# EAGLE design clocktal (EAGLE 7.2.0)
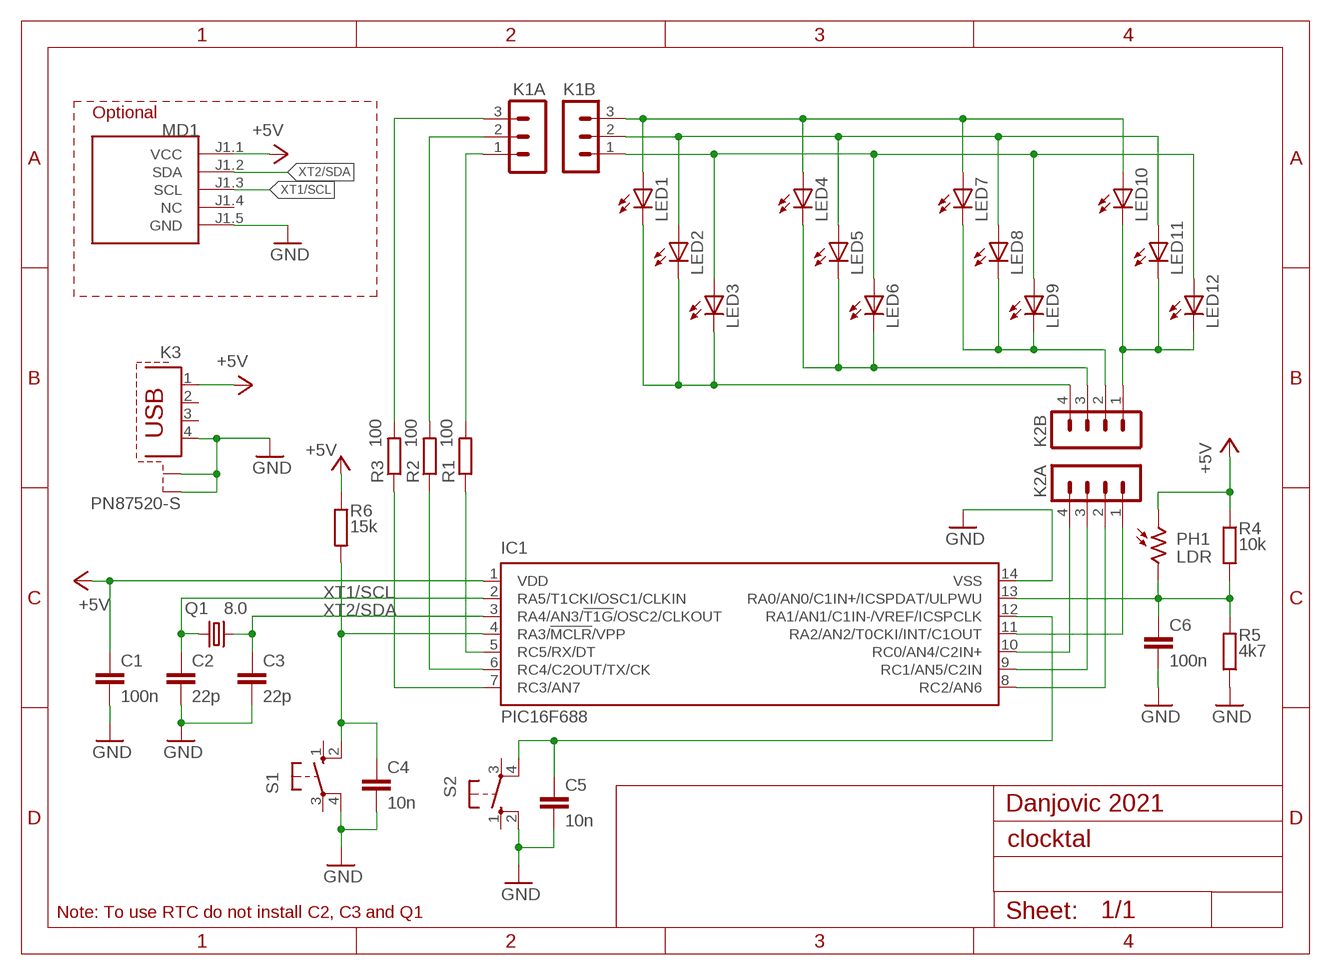
[diagram p0: schematic, sheet 1]

## Parts
C1  100n  C-EUC050-025X075L  [C050-025X75L]
C2  22p  C-EUC050-024X044L  [C050-024X044L]
C3  22p  C-EUC050-024X044L  [C050-024X044L]
C4  10n  C-EUC050-025X075L  [C050-025X75L]
C5  10n  C-EUC050-025X075L  [C050-025X75L]
C6  100n  C-EUC050-025X075L  [C050-025X75L]
IC1  PIC16F688  [DIL14]
K1A  MA03-1  [MA03-1]
K1B  MA03-1  [MA03-1]
K2A  MA04-1  [MA04-1]
K2B  MA04-1  [MA04-1]
K3  PN87520-S  [PN87520-S]
LED1  LED3MM_L  [LED3MM_L]
LED2  LED3MM_L  [LED3MM_L]
LED3  LED3MM_L  [LED3MM_L]
LED4  LED3MM_L  [LED3MM_L]
LED5  LED3MM_L  [LED3MM_L]
LED6  LED3MM_L  [LED3MM_L]
LED7  LED3MM_L  [LED3MM_L]
LED8  LED3MM_L  [LED3MM_L]
LED9  LED3MM_L  [LED3MM_L]
LED10  LED3MM_L  [LED3MM_L]
LED11  LED3MM_L  [LED3MM_L]
LED12  LED3MM_L  [LED3MM_L]
MD1  RTC-DS3231_L  [RTC-DS3231-SMALL_L]
PH1  LDR  A1050_09  [T0-46-A10XX]
Q1  8.0  CRYSTALHC49U-V  [HC49U-V]
R1  100  R-EU_0204/7L  [0204/7L]
R2  100  R-EU_0204/7L  [0204/7L]
R3  100  R-EU_0204/7L  [0204/7L]
R4  10k  R-EU_0204/7L  [0204/7L]
R5  4k7  R-EU_0204/7L  [0204/7L]
R6  15k  R-EU_0204/7L  [0204/7L]
S1  10-XX  [B3F-10XX]
S2  10-XX  [B3F-10XX]

## Nets
+5V: C1.1 IC1.1(VDD) K3.1 MD1.J1.1(VCC) PH1.1 R4.1 R6.1
B0: K1B.1 LED3.A LED6.A LED9.A LED12.A
B1: K1B.2 LED2.A LED5.A LED8.A LED11.A
B2: K1B.3 LED1.A LED4.A LED7.A LED10.A
BIT0: IC1.5(RC5/RX/DT) R1.1
BIT0A: K1A.1 R1.2
BIT1: IC1.6(RC4/C2OUT/TX/CK) R2.1
BIT1A: K1A.2 R2.2
BIT2: IC1.7(RC3/AN7) R3.1
BIT2A: K1A.3 R3.2
BUTTON1: C4.1 IC1.4(RA3/!MCLR!/VPP) R6.2 S1.2(S1)
BUTTON2: C5.1 IC1.12(RA1/AN1/C1IN-/VREF/ICSPCLK) S2.4(P1)
DGT0: K2B.1 LED10.K(C) LED11.K(C) LED12.K(C)
DGT1: K2B.2 LED7.K(C) LED8.K(C) LED9.K(C)
DGT2: K2B.3 LED4.K(C) LED5.K(C) LED6.K(C)
DGT3: K2B.4 LED1.K(C) LED2.K(C) LED3.K(C)
DIGIT0: IC1.11(RA2/AN2/T0CKI/INT/C1OUT) K2A.1
DIGIT1: IC1.8(RC2/AN6) K2A.2
DIGIT2: IC1.9(RC1/AN5/C2IN) K2A.3
DIGIT3: IC1.10(RC0/AN4/C2IN+) K2A.4
GND: C1.2 C2.2 C3.2 C4.2 C5.2 C6.2 IC1.14(VSS) K3.4 K3.S1 K3.S2 MD1.J1.5(GND) R5.1 S1.4(P1) S2.2(S1)
LDR: C6.1 IC1.13(RA0/AN0/C1IN+/ICSPDAT/ULPWU) PH1.2 R4.2 R5.2
XT1/SCL: C2.1 IC1.2(RA5/T1CKI/OSC1/CLKIN) MD1.J1.3(SCL) Q1.1
XT2/SDA: C3.1 IC1.3(RA4/AN3/!T1G!/OSC2/CLKOUT) MD1.J1.2(SDA) Q1.2
Unconnected: K3.2 K3.3 MD1.J1.4(NC) S1.1(S) S1.3(P) S2.1(S) S2.3(P)

## Notes on the sheet
- Optional
- Danjovic 2021
- Note: To use RTC do not install C2, C3 and Q1

## Library data of the parts
C1-C6 = rcl:C-EU: CAPACITOR, European symbol
IC1 = microchip:PIC16F68*
K1A K1B = con-lstb:MA03-1: PIN HEADER; OC_FARNELL: unknown; OC_NEWARK: unknown
K2A K2B = con-lstb:MA04-1: PIN HEADER; OC_FARNELL: unknown; OC_NEWARK: unknown
K3 = con-berg:PN87520-S; OC_FARNELL: unknown; OC_NEWARK: unknown
LED1-LED12 = led:LED: LED OSRAM: - CHIPLED LG R971, LG N971, LY N971, LG Q971, LY Q971, LO R971, LY R971 LH N974, LH R974 LS Q976, LO Q976, LY Q976 LO Q996 - Hyper CHIPLED LW Q18S LB Q993, LB Q99A, LB R99A - SideLED LS A670, LO A670, LY A670, LG A670, LP A670 LB A673, LV A673, LT A673, LW A673 LH A674 LY A675 LS A676, LA A676, LO A676, LY A676, LW A676 LS A679, LY A679, LG A679 - Hyper Micro SIDELED® LS Y876, LA Y876, LO Y876, LY Y876 LT Y87S - SmartLED LW L88C, LW L88S LB L89C, LB L89S, LG L890 LS L89K, LO L89K, LY L89K LS L896, LA L896, LO L896, LY L896 - TOPLED LS T670, LO T670, LY T670, LG T670, LP T670 LSG T670, LSP T670, LSY T670, LOP T670, LYG T670 LG T671, LOG T671, LSG T671 LB T673, LV T673, LT T673, LW T673 LH T674 LS T676, LA T676, LO T676, LY T676, LB T676, LH T676, LSB T676, LW T676 LB T67C, LV T67C, LT T67C, LS T67K, LO T67K, LY T67K, LW E67C LS E67B, LA E67B, LO E67B, LY E67B, LB E67C, LV E67C, LT E67C LW T67C LS T679, LY T679, LG T679 LS T770, LO T770, LY T770, LG T770, LP T770 LB T773, LV T773, LT T773, LW T773 LH T774 LS E675, LA E675, LY E675, LS T675 LS T776, LA T776, LO T776, LY T776, LB T776 LHGB T686 LT T68C, LB T68C - Hyper Mini TOPLED® LB M676 - Mini TOPLED Santana® LG M470 LS M47K, LO M47K, LY M47K Source: http://www.osram.convergy.de LUXEON: - LUMILED® LXK2-PW12-R00, LXK2-PW12-S00, LXK2-PW14-U00, LXK2-PW14-V00 LXK2-PM12-R00, LXK2-PM12-S00, LXK2-PM14-U00 LXK2-PE12-Q00, LXK2-PE12-R00, LXK2-PE12-S00, LXK2-PE14-T00, LXK2-PE14-U00 LXK2-PB12-K00, LXK2-PB12-L00, LXK2-PB12-M00, LXK2-PB14-N00, LXK2-PB14-P00, LXK2-PB14-Q00 LXK2-PR12-L00, LXK2-PR12-M00, LXK2-PR14-Q00, LXK2-PR14-R00 LXK2-PD12-Q00, LXK2-PD12-R00, LXK2-PD12-S00 LXK2-PH12-R00, LXK2-PH12-S00 LXK2-PL12-P00, LXK2-PL12-Q00, LXK2-PL12-R00 Source: www.luxeon.com KINGBRIGHT: KA-3528ASYC Source: www.kingbright.com
MD1 = RTC:RTC-DS3231
PH1 = photo-elements:A10: Sensor Robust Light Sensing Applications Outdoor Light Sensing Application Source: http://optoelectronics.perkinelmer.com/content/Datasheets/DTS_PhotocellsA1050.pdf
Q1 = crystal:CRYSTAL: CRYSTAL; OC_FARNELL: 1666969; OC_NEWARK: unknown
R1-R6 = rcl:R-EU_: RESISTOR, European symbol
S1 S2 = switch-omron:10-XX: OMRON SWITCH; MPN: B3F-1000; OC_FARNELL: 176432; OC_NEWARK: 36M3542

## Board
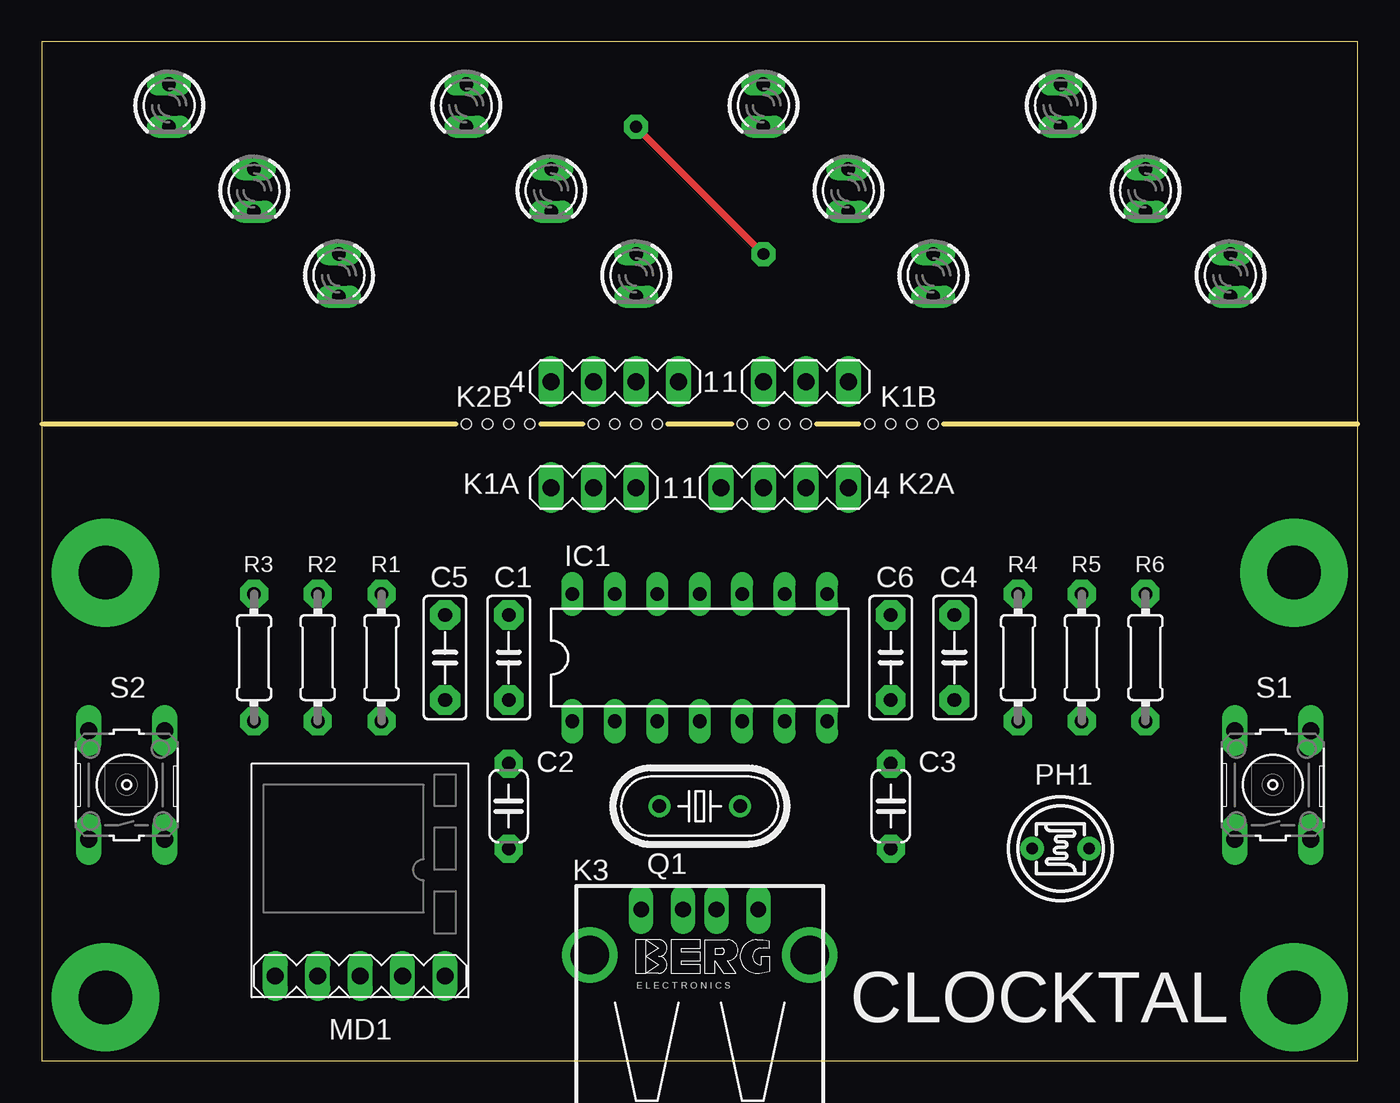
[diagram p1: board, top side]
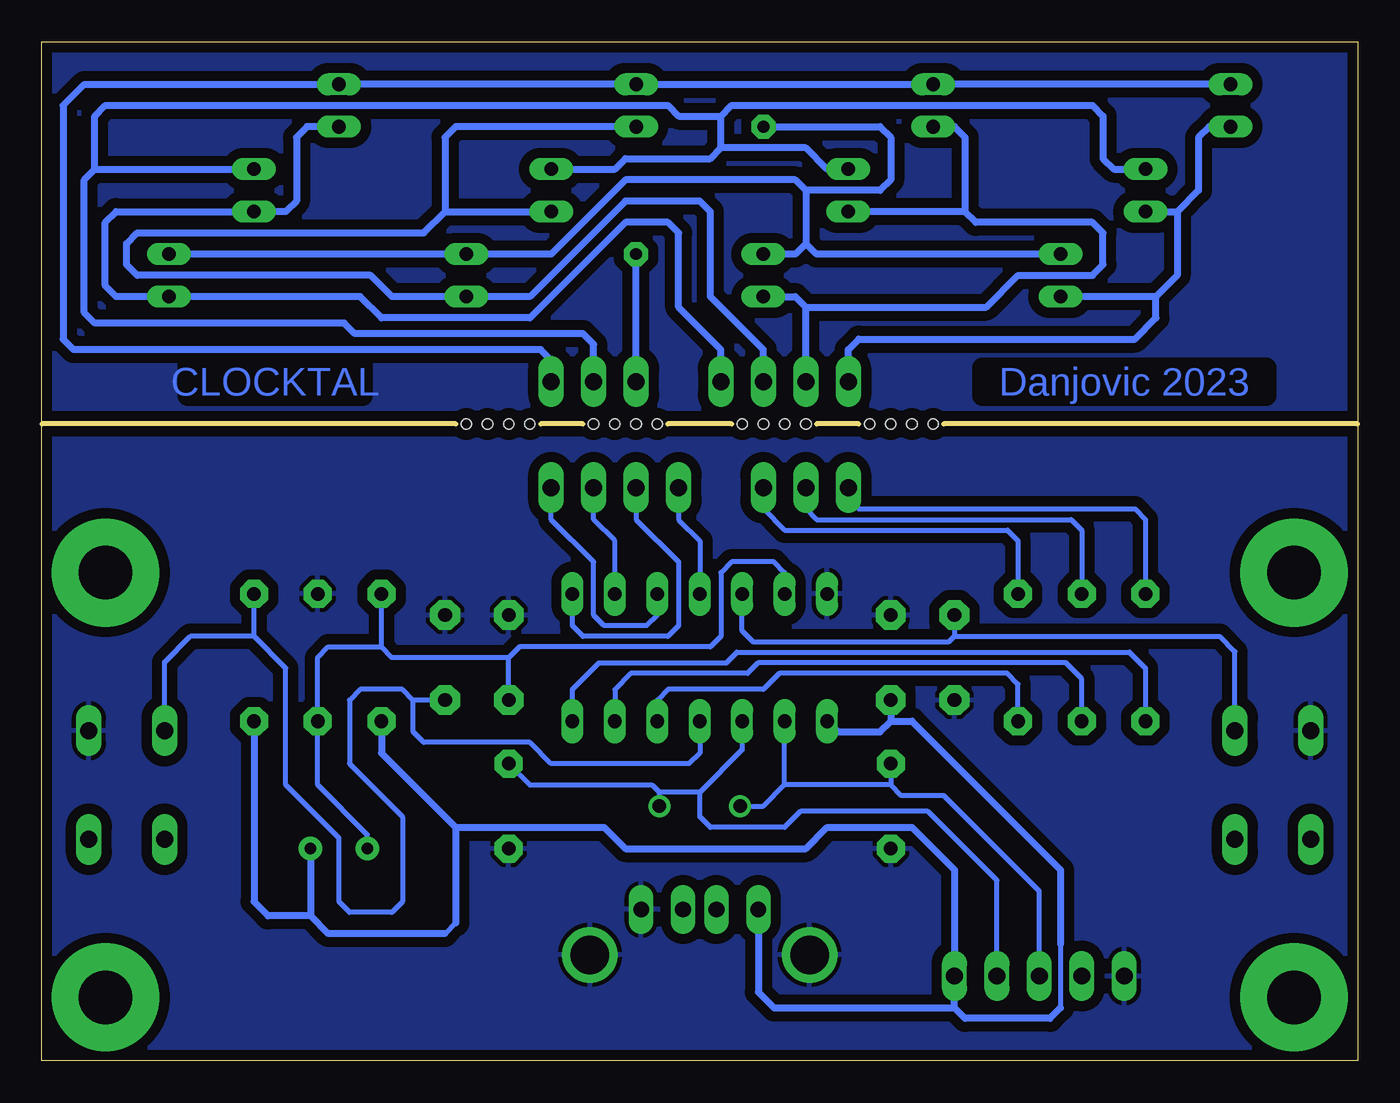
[diagram p2: board, bottom side, seen from below]

Size 78.74 x 60.96 mm. Coordinates in mm from the lower left corner, seen from the top.
Outline: 0,0 78.74,0 78.74,60.96 0,60.96 0,0
Copper layers (1*16): Top 0.035mm / dielectric 1.5mm / Bottom 0.035mm
Design rules "default *": minimum track width 10mil, minimum drill 24mil, track to track 8mil, track to pad 8mil, pad to pad 8mil, via to via 8mil, smd to smd 8mil, copper to edge 25mil, drill to drill 8mil, minimum pad ring 10mil, minimum via ring 8mil, stop-mask expansion 4mil, vias tented up to drill 0mil, thermal gap 10mil
Holes 0.6 mm at 25.4,38.1 27.94,38.1 33.02,38.1 35.56,38.1 43.18,38.1 45.72,38.1 50.8,38.1 53.34,38.1 29.21,38.1 34.29,38.1 36.83,38.1 41.91,38.1 44.45,38.1 49.53,38.1 52.07,38.1 26.67,38.1
bRestrict: 5 lines
Milling: 5 lines

### Footprints (pad centres in the part's own frame; a part is rotated, then mirrored left to right if it is on the bottom)
C050-025X75L = drill 0.813 pad 1.778 octagon: 1 -2.54,0; 2 2.54,0
C050-024X044L = drill 0.813 pad 1.676 octagon: 1 -2.54,0; 2 2.54,0
DIL14 = drill 0.813 long: 1 -7.62,-3.81; 2 -5.08,-3.81; 3 -2.54,-3.81; 4 0,-3.81; 5 2.54,-3.81; 6 5.08,-3.81; 7 7.62,-3.81; 8 7.62,3.81; 9 5.08,3.81; 10 2.54,3.81; 11 0,3.81; 12 -2.54,3.81; 13 -5.08,3.81; 14 -7.62,3.81
MA03-1 = drill 1.016 long: 1 -2.54,0; 2 0,0; 3 2.54,0
MA04-1 = drill 1.016 long: 1 -3.81,0; 2 -1.27,0; 3 1.27,0; 4 3.81,0
PN87520-S = drill 0.95 long: 1 -3.5,2.71; 2 -1,2.71; 3 1,2.71; 4 3.5,2.71 | drill 2.3 pad 2.9: S1 -6.57,0; S2 6.57,0
LED3MM_L = drill 0.813 long: A -1.27,0; K 1.27,0
RTC-DS3231-SMALL_L = drill 1 long: J1.1 -5.08,6.35; J1.2 -2.54,6.35; J1.3 0,6.35; J1.4 2.54,6.35; J1.5 5.08,6.35
T0-46-A10XX = drill 0.7 pad 1.4: 1 -1.7,0; 2 1.7,0
HC49U-V = drill 0.813: 1 -2.413,0; 2 2.413,0
0204/7L = drill 0.813 pad 1.676 octagon: 1 -3.81,0; 2 3.81,0
B3F-10XX = drill 1.016 long: 1 -3.251,2.261; 2 3.251,2.261; 3 -3.251,-2.261; 4 3.251,-2.261

### Placement (x,y rotation side)
C1  27.94,24.13 90 top
C2  27.94,15.24 270 top
C3  50.8,15.24 270 top
C4  54.61,24.13 90 top
C5  24.13,24.13 270 top
C6  50.8,24.13 90 top
IC1  39.37,24.13 0 top
K1A  33.02,34.29 180 top
K1B  45.72,40.64 0 top
K2A  44.45,34.29 0 top
K2B  34.29,40.64 180 top
K3  39.37,6.35 0 top
LED1  7.62,57.15 270 top
LED2  12.7,52.07 270 top
LED3  17.78,46.99 270 top
LED4  25.4,57.15 270 top
LED5  30.48,52.07 270 top
LED6  35.56,46.99 270 top
LED7  43.18,57.15 270 top
LED8  48.26,52.07 270 top
LED9  53.34,46.99 270 top
LED10  60.96,57.15 270 top
LED11  66.04,52.07 270 top
LED12  71.12,46.99 270 top
MD1  19.05,11.43 180 top
PH1  60.96,12.7 180 top
Q1  39.37,15.24 0 top
R1  20.32,24.13 90 top
R2  16.51,24.13 90 top
R3  12.7,24.13 90 top
R4  58.42,24.13 90 top
R5  62.23,24.13 270 top
R6  66.04,24.13 90 top
S1  73.66,16.51 90 top
S2  5.08,16.51 90 top

### Tracks (layer width: path | path; a pad name or v marks a point on that pad's centre or on a via)
+5V
  Bottom 0.305: 53.98,8.26 54.61,7.62 | 17.78,6.99 17.78,3.17
  Bottom 0.406: R6.1 66.04,9.53 65.2,8.69 62.66,8.69 | K3.1 35.87,4.12 34.92,3.17 24.13,3.17 | 24.13,3.17 MD1.J1.1 24.13,11.43 26.67,13.97 31.75,13.97 33.02,12.7 43.81,12.7 45.09,13.97 53.98,13.97 | IC1.1 31.11,19.68 28.57,19.68 27.94,20.32 | 27.94,20.32 26.67,20.32 17.78,11.43 17.78,6.99 | 17.78,3.17 18.41,2.54 23.5,2.54 24.13,3.17 | R4.1 58.42,18.41 53.98,13.97 | 53.98,13.97 53.98,8.26 | 54.61,7.62 61.59,7.62 62.66,8.69 | PH1.1 62.66,8.69 | C1.1 27.94,20.32
B0  (via drill 0.7 pad 1.42)
  Top 0.406: v43.18,48.26 v35.56,55.88
  Bottom 0.406: LED3.A 32.38,48.26 33.02,48.9 | 33.02,48.9 33.66,48.26 LED6.A | LED12.A LED9.A 48.26,48.26 43.81,52.7 33.66,52.7 33.02,52.07 | K1B.1 v43.18,48.26 | v35.56,55.88 28.57,55.88 27.94,55.24 27.94,52.7 28.57,52.07 33.02,52.07 | 33.02,52.07 33.02,48.9
B1
  Bottom 0.406: 75.56,53.34 75.56,56.52 74.93,57.15 41.27,57.15 40.64,56.52 38.1,56.52 | 38.1,56.52 37.47,57.15 15.88,57.15 15.24,56.52 15.24,53.98 14.61,53.34 LED2.A | K1B.2 45.72,42.86 46.35,43.5 60.01,43.5 60.64,44.13 75.56,44.13 76.2,44.77 76.2,52.7 75.56,53.34 | 75.56,53.34 LED11.A | LED8.A 44.45,53.34 43.81,53.98 38.73,53.98 38.1,54.61 | LED5.A 31.75,53.34 33.02,54.61 38.1,54.61 | 38.1,54.61 38.1,56.52
B2
  Bottom 0.406: LED1.A LED4.A LED7.A LED10.A 76.2,58.42 77.47,57.15 77.47,43.18 76.83,42.55 48.9,42.55 48.26,41.91 K1B.3
BIT0
  Bottom 0.305: R1.1 20.32,22.54 20.95,23.18 34.61,23.18 35.56,22.23 41.27,22.23 41.91,21.59 IC1.5
BIT0A
  Bottom 0.305: K1A.1 35.56,33.02 34.29,31.75 20.95,31.75 20.32,31.11 R1.2
BIT1
  Bottom 0.305: R2.1 16.51,22.86 17.46,23.81 35.88,23.81 36.51,23.18 43.5,23.18 44.45,22.23 IC1.6
BIT1A
  Bottom 0.305: K1A.2 33.02,33.02 32.38,32.38 17.14,32.38 16.51,31.75 R2.2
BIT2
  Bottom 0.305: IC1.7 46.99,22.23 45.4,23.81 37.78,23.81 37.15,24.45 13.65,24.45 12.7,23.5 R3.1
BIT2A
  Bottom 0.305: K1A.3 30.48,33.66 29.84,33.02 13.34,33.02 12.7,32.38 R3.2
BUTTON1
  Bottom 0.305: IC1.4 39.37,18.41 40.01,17.78 48.26,17.78 49.53,19.05 55.88,19.05 56.52,19.68 56.52,21.59 | C4.1 56.52,21.59 | 56.52,21.59 57.15,22.23 59.69,22.23 60.33,21.59 60.33,17.78 57.15,14.61 57.15,9.53 57.78,8.89 60.33,8.89 60.96,9.53 60.96,13.34 64.14,16.51 64.14,23.5 66.04,25.4 | 66.04,25.4 R6.2 | 66.04,25.4 69.85,25.4 71.4,23.85 S1.2
BUTTON2
  Bottom 0.305: 24.13,25.4 24.45,25.08 36.2,25.08 36.83,25.72 IC1.12 | 24.13,25.4 8.26,25.4 7.34,24.49 S2.4 | C5.1 24.13,25.4
DGT0
  Bottom 0.406: LED10.K 62.87,55.88 63.5,55.24 63.5,51.44 64.14,50.8 LED11.K 74.3,50.8 74.93,50.16 74.93,46.35 74.3,45.72 LED12.K 59.69,45.72 58.42,44.45 49.53,44.45 43.81,50.16 41.27,50.16 40.64,49.53 40.64,45.09 38.1,42.55 K2B.1
DGT1
  Bottom 0.406: K2B.2 35.56,42.55 38.73,45.72 38.73,50.8 39.37,51.44 43.81,51.44 49.53,45.72 LED9.K 57.78,45.72 59.05,46.99 73.03,46.99 73.66,47.62 73.66,48.9 73.03,49.53 55.88,49.53 54.61,50.8 | 54.61,50.8 LED8.K | LED7.K 53.98,55.88 54.61,55.24 54.61,50.8
DGT2
  Bottom 0.406: K2B.3 33.02,45.09 | 33.02,45.09 22.23,45.09 20.32,46.99 15.88,46.99 15.24,47.62 15.24,49.53 15.88,50.16 22.86,50.16 23.5,50.8 | 23.5,50.8 LED5.K | LED4.K 24.13,55.88 23.5,55.24 23.5,50.8 | LED6.K 33.66,45.72 33.02,45.09
DGT3
  Bottom 0.406: LED1.K 8.89,55.88 9.53,55.24 9.53,52.07 10.79,50.8 | 10.79,50.8 10.79,46.99 12.06,45.72 | LED2.K 10.79,50.8 | K2B.4 30.48,42.55 29.84,43.18 13.34,43.18 12.06,44.45 12.06,45.72 | 12.06,45.72 LED3.K
DIGIT0
  Bottom 0.305: K2A.1 40.64,32.38 39.37,31.11 IC1.11
DIGIT1
  Bottom 0.305: K2A.2 43.18,32.38 40.64,29.84 40.64,26.04 41.27,25.4 46.35,25.4 46.99,26.04 IC1.8
DIGIT2
  Bottom 0.305: IC1.9 44.45,31.11 45.72,32.38 K2A.3
DIGIT3
  Bottom 0.305: IC1.10 41.91,26.67 42.55,26.04 45.09,26.04 45.72,26.67 45.72,29.84 48.26,32.38 K2A.4
GND
  pour Bottom (isolate 0.61): 0,-0.64 78.74,-0.64 78.74,38.1 0,38.1
LDR
  Bottom 0.305: IC1.13 34.29,29.21 34.92,29.84 37.47,29.84 38.1,29.21 38.1,25.4 38.73,24.77 50.16,24.77 50.8,24.13 | 50.8,24.13 57.78,24.13 58.42,24.77 | 58.42,24.77 61.59,24.77 62.23,24.13 R5.2 62.23,16.51 59.26,13.54 PH1.2 | 58.42,24.77 R4.2 | C6.1 50.8,24.13
N$3  (via drill 3.2 pad 6.45)
  other vias: 3.81,29.21
N$4
  pour Bottom (isolate 0.61): 0,60.96 0,38.1 78.74,38.1 78.74,60.96
N$5  (via drill 3.2 pad 6.45)
  other vias: 3.81,3.81
N$6  (via drill 3.2 pad 6.45)
  other vias: 74.93,3.81
N$7  (via drill 3.2 pad 6.45)
  other vias: 74.93,29.21
XT1/SCL
  Bottom 0.305: MD1.J1.3 19.05,10.16 24.77,15.88 27.3,15.88 27.94,16.51 | C2.1 27.94,16.51 | 27.94,16.51 34.29,16.51 | 34.29,16.51 IC1.2 | Q1.1 35.56,15.24 34.29,16.51
XT2/SDA
  Bottom 0.305: MD1.J1.2 21.59,10.79 25.72,14.92 33.34,14.92 34.29,13.97 38.73,13.97 39.37,14.61 39.37,16.07 | C3.1 49.53,16.51 42.23,16.51 41.78,16.07 | Q1.2 41.78,16.07 | 39.37,16.07 41.78,16.07 | IC1.3 36.83,18.61 39.37,16.07

### Text on the board
Bottom: Danjovic 2023 | CLOCKTAL
tNames: CLOCKTAL